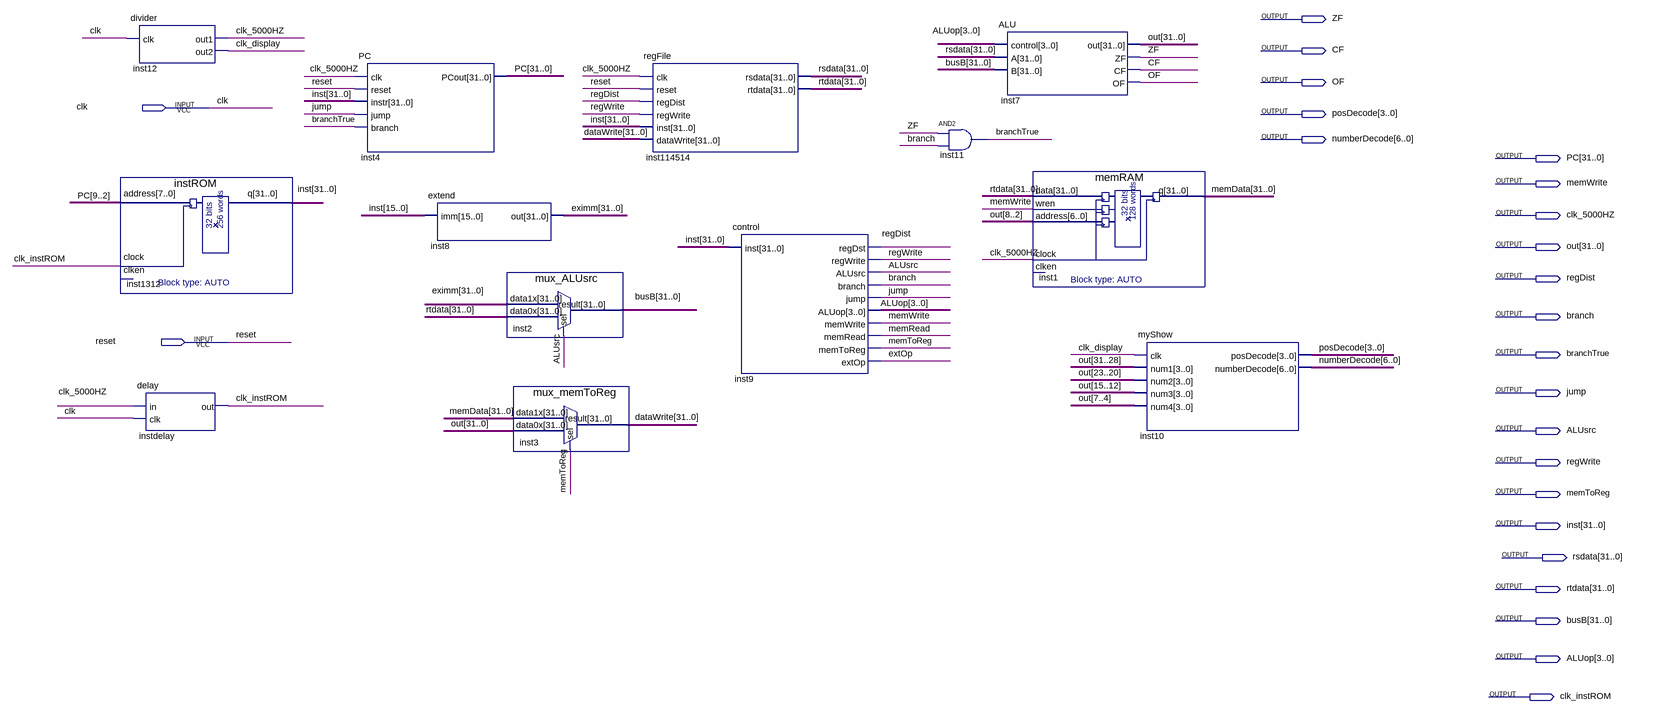
[diagram p0: schematic sheet]
// Quartus schematic top.bdf as structural Verilog: 13 symbols, 24 pins
module top (
  input  clk,
  input  reset,
  output ZF,
  output CF,
  output OF,
  output [3:0] posDecode,
  output [6:0] numberDecode,
  output [31:0] PC,
  output memWrite,
  output clk_5000HZ,
  output [31:0] out,
  output regDist,
  output branch,
  output branchTrue,
  output jump,
  output ALUsrc,
  output regWrite,
  output memToReg,
  output [31:0] inst,
  output [31:0] rsdata,
  output [31:0] rtdata,
  output [31:0] busB,
  output [3:0] ALUop,
  output clk_instROM
);

  wire clk_display, extOp, memRead;
  wire [31:0] dataWrite, eximm, memData;

  divider inst12 (.clk(clk), .out1(clk_5000HZ), .out2(clk_display));
  instROM inst1312 (.address(PC[9:2]), .clock(clk_instROM), .q(inst));  // open: clken
  delay instdelay (.in(clk_5000HZ), .clk(clk), .out(clk_instROM));
  PC inst4 (.clk(clk_5000HZ), .reset(reset), .instr(inst), .jump(jump), .branch(branchTrue), .PCout(PC));
  extend inst8 (.imm(inst[15:0]), .out(eximm));
  mux_ALUsrc inst2 (.data1x(eximm), .data0x(rtdata), .sel(ALUsrc), .result(busB));
  mux_memToReg inst3 (.data1x(memData), .data0x(out), .sel(memToReg), .result(dataWrite));
  regFile inst114514 (
    .clk(clk_5000HZ), .reset(reset), .regDist(regDist), .regWrite(regWrite), .inst(inst),
    .dataWrite(dataWrite), .rsdata(rsdata), .rtdata(rtdata));
  control inst9 (
    .inst(inst), .regDst(regDist), .regWrite(regWrite), .ALUsrc(ALUsrc), .branch(branch), .jump(jump),
    .ALUop(ALUop), .memWrite(memWrite), .memRead(memRead), .memToReg(memToReg), .extOp(extOp));
  and inst11 (branchTrue, ZF, branch);
  ALU inst7 (.control(ALUop), .A(rsdata), .B(busB), .out(out), .ZF(ZF), .CF(CF), .OF(OF));
  memRAM inst1 (.data(rtdata), .wren(memWrite), .address(out[8:2]), .clock(clk_5000HZ), .q(memData));  // open: clken
  myShow inst10 (
    .clk(clk_display), .num1(out[31:28]), .num2(out[23:20]), .num3(out[15:12]), .num4(out[7:4]),
    .posDecode(posDecode), .numberDecode(numberDecode));
endmodule
